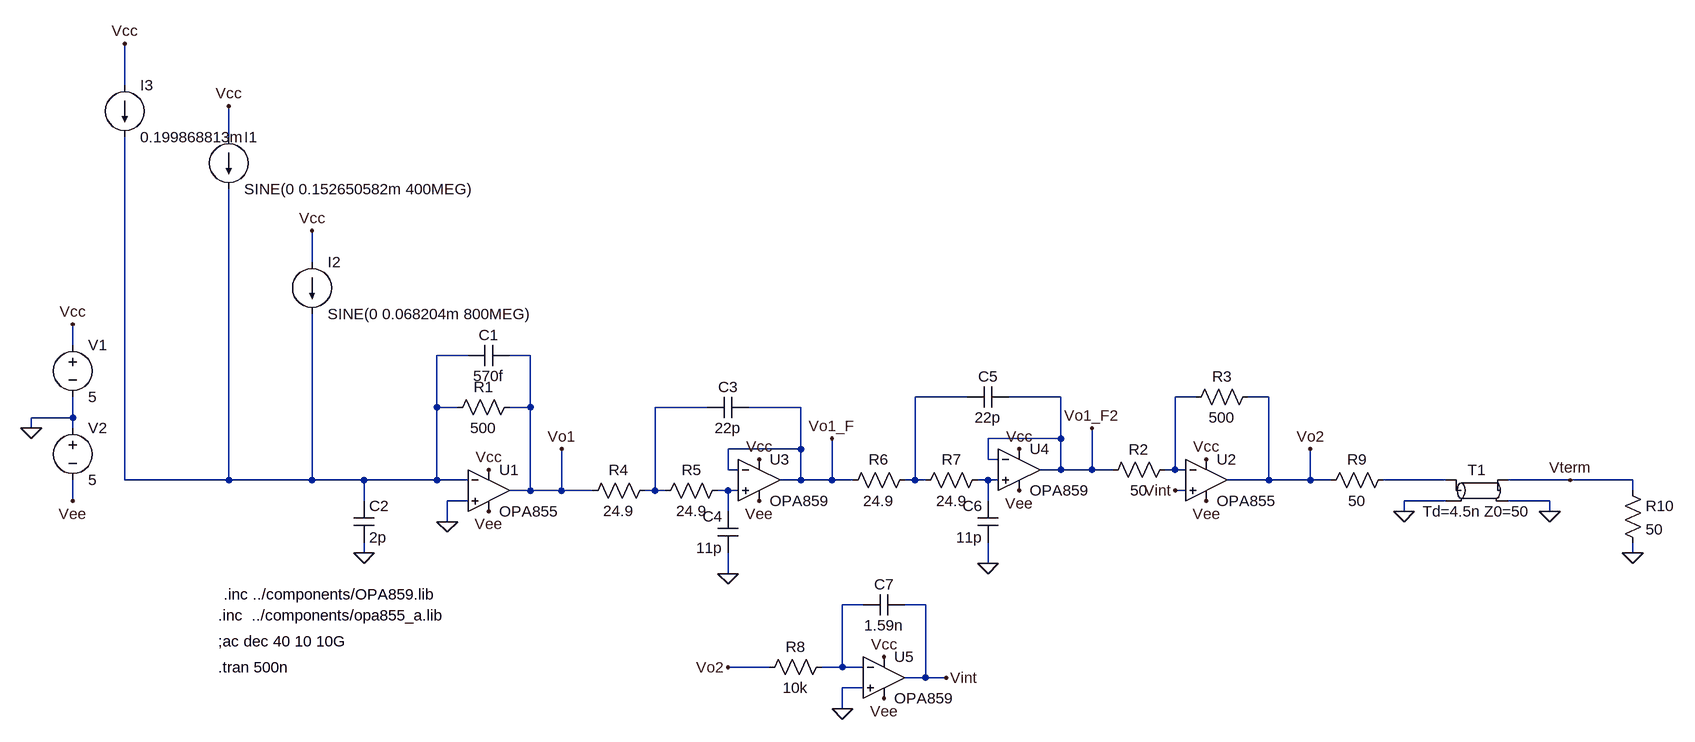
[diagram p0: schematic AnalogFrontEnd.asc]
AnalogFrontEnd.asc, the LTspice schematic file:
Version 4
SHEET 1 2420 724
WIRE 32 -352 32 -416
WIRE 192 -272 192 -320
WIRE 320 -80 320 -128
WIRE -48 48 -48 16
WIRE 560 64 512 64
WIRE 656 64 624 64
WIRE 1328 128 1248 128
WIRE 1472 128 1392 128
WIRE 1680 128 1648 128
WIRE 1792 128 1760 128
WIRE 512 144 512 64
WIRE 544 144 512 144
WIRE 656 144 656 64
WIRE 656 144 624 144
WIRE 928 144 848 144
WIRE 1072 144 992 144
WIRE -48 160 -48 128
WIRE -48 160 -112 160
WIRE -112 176 -112 160
WIRE -48 176 -48 160
WIRE 1472 192 1472 128
WIRE 1472 192 1360 192
WIRE 1072 208 1072 144
WIRE 1072 208 960 208
WIRE 1360 224 1360 192
WIRE 1376 224 1360 224
WIRE 960 240 960 208
WIRE 976 240 960 240
WIRE 1472 240 1472 192
WIRE 1472 240 1440 240
WIRE 1520 240 1520 176
WIRE 1520 240 1472 240
WIRE 1552 240 1520 240
WIRE 1648 240 1648 128
WIRE 1648 240 1632 240
WIRE 1664 240 1648 240
WIRE 32 256 32 -272
WIRE 192 256 192 -192
WIRE 192 256 32 256
WIRE 320 256 320 0
WIRE 320 256 192 256
WIRE 400 256 320 256
WIRE 512 256 512 144
WIRE 512 256 400 256
WIRE 560 256 512 256
WIRE 592 256 592 240
WIRE 1072 256 1072 208
WIRE 1072 256 1040 256
WIRE 1120 256 1120 192
WIRE 1120 256 1072 256
WIRE 1152 256 1120 256
WIRE 1248 256 1248 128
WIRE 1248 256 1232 256
WIRE 1264 256 1248 256
WIRE 1360 256 1344 256
WIRE 1376 256 1360 256
WIRE 1792 256 1792 128
WIRE 1792 256 1728 256
WIRE 1856 256 1856 208
WIRE 1856 256 1792 256
WIRE 1888 256 1856 256
WIRE 2064 256 1968 256
WIRE 2256 256 2160 256
WIRE 2352 256 2256 256
WIRE 656 272 656 144
WIRE 656 272 624 272
WIRE 704 272 704 208
WIRE 704 272 656 272
WIRE 752 272 704 272
WIRE 848 272 848 144
WIRE 848 272 832 272
WIRE 864 272 848 272
WIRE 960 272 944 272
WIRE 976 272 960 272
WIRE 1664 272 1648 272
WIRE 2352 272 2352 256
WIRE -48 288 -48 256
WIRE 400 288 400 256
WIRE 560 288 528 288
WIRE 1360 288 1360 256
WIRE 2064 288 2000 288
WIRE 2224 288 2160 288
WIRE 960 304 960 272
WIRE 2000 304 2000 288
WIRE 2224 304 2224 288
WIRE 528 320 528 288
WIRE 400 368 400 352
WIRE 2352 368 2352 352
WIRE 1360 384 1360 352
WIRE 960 400 960 368
WIRE 1168 448 1136 448
WIRE 1264 448 1232 448
WIRE 1024 544 960 544
WIRE 1136 544 1136 448
WIRE 1136 544 1104 544
WIRE 1168 544 1136 544
WIRE 1264 560 1264 448
WIRE 1264 560 1232 560
WIRE 1296 560 1264 560
WIRE 1168 576 1136 576
WIRE 1136 608 1136 576
FLAG -112 176 0
FLAG -48 16 Vcc
FLAG -48 288 Vee
FLAG 528 320 0
FLAG 592 240 Vcc
FLAG 592 304 Vee
FLAG 400 368 0
FLAG 320 -128 Vcc
FLAG 192 -320 Vcc
FLAG 1696 224 Vcc
FLAG 1696 288 Vee
FLAG 704 208 Vo1
FLAG 1856 208 Vo2
FLAG 1008 224 Vcc
FLAG 1008 288 Vee
FLAG 960 400 0
FLAG 1120 192 Vo1_F
FLAG 1408 208 Vcc
FLAG 1408 272 Vee
FLAG 1360 384 0
FLAG 1520 176 Vo1_F2
FLAG 1648 272 Vint
FLAG 1200 528 Vcc
FLAG 1200 592 Vee
FLAG 1296 560 Vint
FLAG 1136 608 0
FLAG 960 544 Vo2
FLAG 2352 368 0
FLAG 2000 304 0
FLAG 2224 304 0
FLAG 2256 256 Vterm
FLAG 32 -416 Vcc
SYMBOL OpAmps\\opamp2 592 208 R0
SYMATTR InstName U1
SYMATTR Value OPA855
SYMBOL voltage -48 32 R0
WINDOW 123 0 0 Left 0
WINDOW 39 0 0 Left 0
SYMATTR InstName V1
SYMATTR Value 5
SYMBOL voltage -48 160 R0
WINDOW 123 0 0 Left 0
WINDOW 39 0 0 Left 0
SYMATTR InstName V2
SYMATTR Value 5
SYMBOL res 640 128 R90
WINDOW 0 0 56 VBottom 2
WINDOW 3 32 56 VTop 2
SYMATTR InstName R1
SYMATTR Value 500
SYMBOL cap 624 48 R90
WINDOW 0 0 32 VBottom 2
WINDOW 3 32 32 VTop 2
SYMATTR InstName C1
SYMATTR Value 570f
SYMBOL cap 384 288 R0
SYMATTR InstName C2
SYMATTR Value 2p
SYMBOL current 192 -272 R0
WINDOW 123 24 28 Left 2
WINDOW 39 0 0 Left 0
SYMATTR InstName I1
SYMATTR Value SINE(0 0.152650582m 400MEG)
SYMBOL current 320 -80 R0
WINDOW 123 24 28 Left 2
WINDOW 39 0 0 Left 0
SYMATTR InstName I2
SYMATTR Value SINE(0 0.068204m 800MEG)
SYMBOL OpAmps\\opamp2 1696 192 R0
SYMATTR InstName U2
SYMATTR Value OPA855
SYMBOL res 1536 256 R270
WINDOW 0 32 56 VTop 2
WINDOW 3 0 56 VBottom 2
SYMATTR InstName R2
SYMATTR Value 50
SYMBOL res 1664 144 R270
WINDOW 0 32 56 VTop 2
WINDOW 3 0 56 VBottom 2
SYMATTR InstName R3
SYMATTR Value 500
SYMBOL OpAmps\\opamp2 1008 192 R0
SYMATTR InstName U3
SYMATTR Value OPA859
SYMBOL res 848 256 R90
WINDOW 0 0 56 VBottom 2
WINDOW 3 32 56 VTop 2
SYMATTR InstName R4
SYMATTR Value 24.9
SYMBOL res 960 256 R90
WINDOW 0 0 56 VBottom 2
WINDOW 3 32 56 VTop 2
SYMATTR InstName R5
SYMATTR Value 24.9
SYMBOL cap 992 128 R90
WINDOW 0 0 32 VBottom 2
WINDOW 3 32 32 VTop 2
SYMATTR InstName C3
SYMATTR Value 22p
SYMBOL cap 976 368 R180
WINDOW 0 24 56 Left 2
WINDOW 3 24 8 Left 2
SYMATTR InstName C4
SYMATTR Value 11p
SYMBOL OpAmps\\opamp2 1408 176 R0
SYMATTR InstName U4
SYMATTR Value OPA859
SYMBOL res 1248 240 R90
WINDOW 0 0 56 VBottom 2
WINDOW 3 32 56 VTop 2
SYMATTR InstName R6
SYMATTR Value 24.9
SYMBOL res 1360 240 R90
WINDOW 0 0 56 VBottom 2
WINDOW 3 32 56 VTop 2
SYMATTR InstName R7
SYMATTR Value 24.9
SYMBOL cap 1392 112 R90
WINDOW 0 0 32 VBottom 2
WINDOW 3 32 32 VTop 2
SYMATTR InstName C5
SYMATTR Value 22p
SYMBOL cap 1376 352 R180
WINDOW 0 24 56 Left 2
WINDOW 3 24 8 Left 2
SYMATTR InstName C6
SYMATTR Value 11p
SYMBOL OpAmps\\opamp2 1200 496 R0
SYMATTR InstName U5
SYMATTR Value OPA859
SYMBOL res 1120 528 R90
WINDOW 0 0 56 VBottom 2
WINDOW 3 32 56 VTop 2
SYMATTR InstName R8
SYMATTR Value 10k
SYMBOL cap 1232 432 R90
WINDOW 0 0 32 VBottom 2
WINDOW 3 32 32 VTop 2
SYMATTR InstName C7
SYMATTR Value 1.59n
SYMBOL res 1984 240 R90
WINDOW 0 0 56 VBottom 2
WINDOW 3 32 56 VTop 2
SYMATTR InstName R9
SYMATTR Value 50
SYMBOL tline 2112 272 R0
SYMATTR InstName T1
SYMATTR Value Td=4.5n Z0=50
SYMBOL res 2336 256 R0
SYMATTR InstName R10
SYMATTR Value 50
SYMBOL current 32 -352 R0
WINDOW 123 0 0 Left 0
WINDOW 39 0 0 Left 0
SYMATTR InstName I3
SYMATTR Value 0.199868813m
TEXT 176 464 Left 2 !.inc  ../components/opa855_a.lib
TEXT 176 504 Left 2 !;ac dec 40 10 10G
TEXT 176 544 Left 2 !.tran 500n
TEXT 184 432 Left 2 !.inc ../components/OPA859.lib

The netlist it stands for:
* AnalogFrontEnd.asc
XU1 0 N001 Vcc Vee Vo1 OPA855  ; pins In+ In- V+ V- OUT
V1 Vcc 0 5
V2 0 Vee 5
R1 Vo1 N001 500
C1 Vo1 N001 570f
C2 N001 0 2p
I1 Vcc N001 SINE(0 0.152650582m 400MEG)
I2 Vcc N001 SINE(0 0.068204m 800MEG)
XU2 Vint N003 Vcc Vee Vo2 OPA855  ; pins In+ In- V+ V- OUT
R2 Vo1_F2 N003 50
R3 N003 Vo2 500
XU3 N007 Vo1_F Vcc Vee Vo1_F OPA859  ; pins In+ In- V+ V- OUT
R4 N004 Vo1 24.9
R5 N007 N004 24.9
C3 Vo1_F N004 22p
C4 0 N007 11p
XU4 N005 Vo1_F2 Vcc Vee Vo1_F2 OPA859  ; pins In+ In- V+ V- OUT
R6 N002 Vo1_F 24.9
R7 N005 N002 24.9
C5 Vo1_F2 N002 22p
C6 0 N005 11p
XU5 0 N008 Vcc Vee Vint OPA859  ; pins In+ In- V+ V- OUT
R8 N008 Vo2 10k
C7 Vint N008 1.59n
R9 N006 Vo2 50
T1 N006 0 Vterm 0 Td=4.5n Z0=50
R10 Vterm 0 50
I3 Vcc N001 0.199868813m
.inc  ../components/opa855_a.lib
;ac dec 40 10 10G
.tran 500n
.inc ../components/OPA859.lib
.backanno
.end